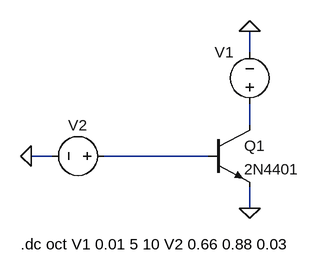
[diagram p0: schematic Ausgangskennlinie.asc]
Ausgangskennlinie.asc, the LTspice schematic file:
Version 4.1
SHEET 1 880 680
WIRE 352 80 352 48
WIRE 352 192 352 160
WIRE 48 240 16 240
WIRE 288 240 128 240
WIRE 352 320 352 288
FLAG 352 48 0
FLAG 352 320 0
FLAG 16 240 0
SYMBOL npn 288 192 R0
SYMATTR InstName Q1
SYMATTR Value 2N4401
SYMBOL voltage 352 176 R180
WINDOW 0 24 96 Left 2
WINDOW 3 24 16 Left 2
WINDOW 123 0 0 Left 0
WINDOW 39 0 0 Left 0
SYMATTR InstName V1
SYMATTR Value ""
SYMBOL voltage 144 240 R90
WINDOW 0 -32 56 VBottom 2
WINDOW 3 32 56 VTop 2
WINDOW 123 0 0 Left 0
WINDOW 39 0 0 Left 0
SYMATTR InstName V2
SYMATTR Value ""
TEXT 0 376 Left 2 !.dc oct V1 0.01 5 10 V2 0.66 0.88 0.03

The netlist it stands for:
* Ausgangskennlinie.asc
Q1 N001 N002 0 0 2N4401
V1 N001 0
V2 N002 0
.model NPN NPN
.model PNP PNP
.lib standard.bjt
.dc oct V1 0.01 5 10 V2 0.66 0.88 0.03
.backanno
.end